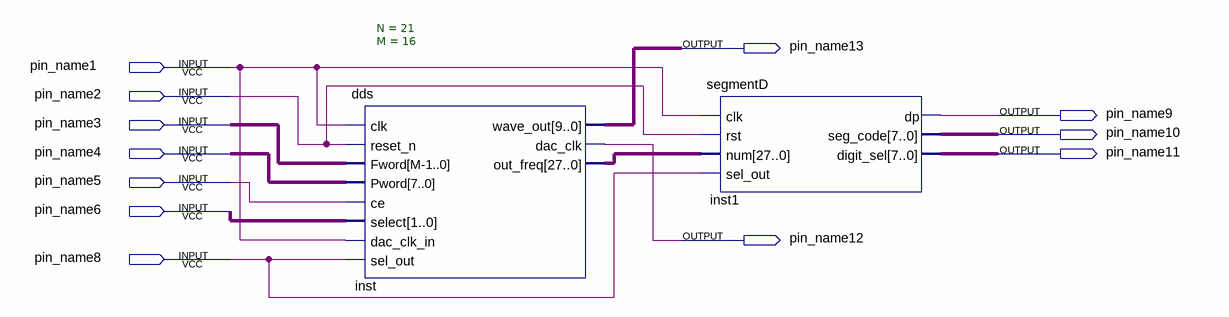
[diagram p0: schematic sheet]
// Quartus schematic dds.bdf as structural Verilog: 2 symbols, 12 pins
module dds (
  input  pin_name1,
  input  pin_name2,
  input  pin_name3,
  input  pin_name4,
  input  pin_name5,
  input  pin_name6,
  input  pin_name8,
  output pin_name13,
  output pin_name9,
  output pin_name10,
  output pin_name11,
  output pin_name12
);

  wire [1:0] undriven_3;
  wire [7:0] inst1_digit_sel, inst1_seg_code, undriven;
  wire [9:0] inst_wave_out;
  wire [15:0] undriven_2;
  wire [27:0] inst_out_freq;

  dds #(.N(21), .M(16)) inst (
    .clk(pin_name1), .reset_n(pin_name2), .Fword(undriven_2), .Pword(undriven), .ce(pin_name5),
    .select(undriven_3), .dac_clk_in(pin_name1), .sel_out(pin_name8), .wave_out(inst_wave_out),
    .dac_clk(pin_name12), .out_freq(inst_out_freq));
  segmentD inst1 (
    .clk(pin_name1), .rst(pin_name2), .num(inst_out_freq), .sel_out(pin_name8), .dp(pin_name9),
    .seg_code(inst1_seg_code), .digit_sel(inst1_digit_sel));
endmodule
